# Altium project PCB_Project2.PrjPCB
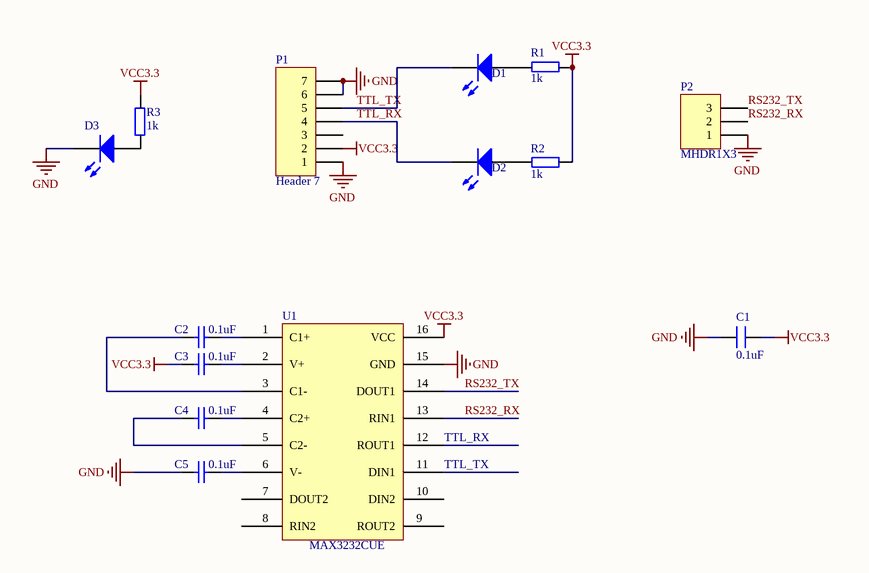
[diagram p0: Sheet1.SchDoc]
1 sheet, 14 parts. Net scope: global (net labels, ports and power ports of the same name join across sheets).
Board file: PCB1.PcbDoc

## Sheet Sheet1.SchDoc
size A4

### Parts
C1  0.1uF  [C0805]
C2  0.1uF  [C0805]
C3  0.1uF  [C0805]
C4  0.1uF  [C0805]
C5  0.1uF  [C0805]
D1  LED0  [LC-0805_LED_S1]  (value not drawn)
D2  LED0  [LC-0805_LED_S1]  (value not drawn)
D3  LED0  [LC-0805_LED_S1]  (value not drawn)
P1  Header 7  [AS50-T27]
P2  MHDR1X3  [DZ-3-3.5]
R1  1k  [0805]
R2  1k  [0805]
R3  1k  [0805]
U1  MAX3232CUE  [SO-16]

### Nets
GND: C1.1 C5.2 D3.K P1.1 P1.6 P1.7 P2.1 U1.15(GND)
VCC3.3: C1.2 C3.2 P1.2 R1.1 R2.2 R3.1 U1.16(VCC)
RS232_RX: P2.2 U1.13(RIN1)
RS232_TX: P2.3 U1.14(DOUT1)
TTL_RX: D2.K P1.4 U1.12(ROUT1)
TTL_TX: D1.K P1.5 U1.11(DIN1)
NetC2_1: C2.1 U1.1(C1+)
NetC2_2: C2.2 U1.3(C1-)
NetC3_1: C3.1 U1.2(V+)
NetC4_1: C4.1 U1.4(C2+)
NetC4_2: C4.2 U1.5(C2-)
NetC5_1: C5.1 U1.6(V-)
NetD1_A: D1.A R1.2
NetD2_A: D2.A R2.1
NetD3_A: D3.A R3.2

Not connected (* = marked no-connect by the designer): P1 3; U1 7(DOUT2) 8(RIN2) 9(ROUT2) 10(DIN2)

### Library data of the parts
C1 = C_2
C2-C5 = Cap: Capacitor; Published: 8-Jun-2000; LatestRevisionDate: 17-Jul-2002; LatestRevisionNote: Re-released for DXP Platform.; PackageReference: RAD-0.3; Publisher: Altium Limited; PackageDescription: Radial Cap, Thru-Hole; 2 Leads; 0.3 in Pin Spacing; Value: 0.1uF
D1-D3 = LED0: Typical INFRARED GaAs LED; Published: 8-Jun-2000; LatestRevisionDate: 08-Jul-2005; LatestRevisionNote: Mech Layer 1 removed.; PackageReference: LED-0; Publisher: Altium Limited; PackageDescription: LED; 2 Leads
P1 = Header 7: Header, 7-Pin; LatestRevisionDate: 17-Jul-2002; LatestRevisionNote: Re-released for DXP Platform.; Publisher: Altium Limited
P2 = MHDR1X3: Header, 3-Pin; LatestRevisionDate: 17-Jul-2002; LatestRevisionNote: Re-released for DXP Platform.; Publisher: Altium Limited
R1-R3 = R_2